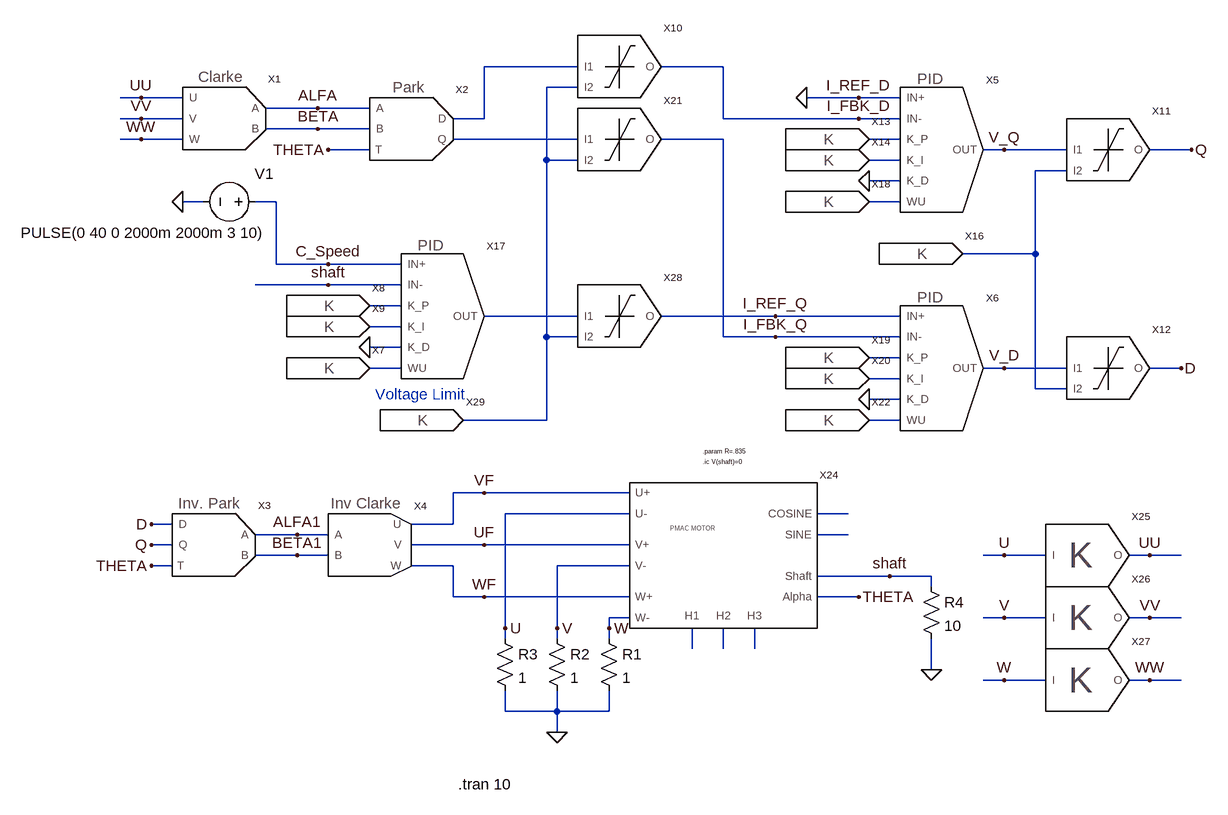
[diagram p0: schematic PMSM_Control.asc]
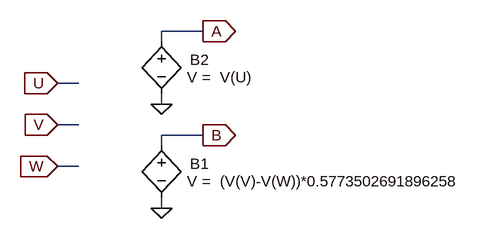
[diagram p1: sub-circuit clarke.asc]
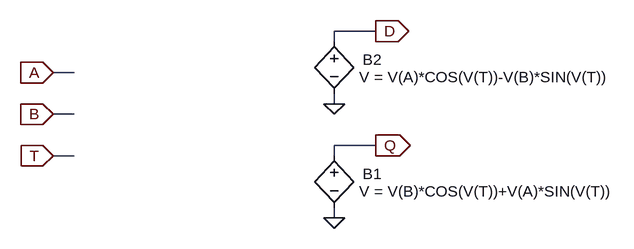
[diagram p2: sub-circuit park.asc]
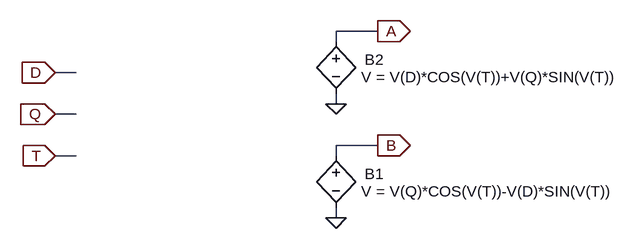
[diagram p3: sub-circuit inv_park.asc]
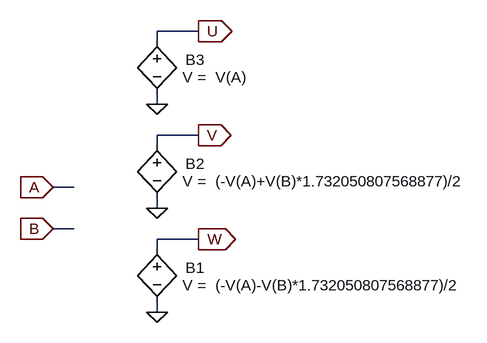
[diagram p4: sub-circuit inv_clarke.asc]
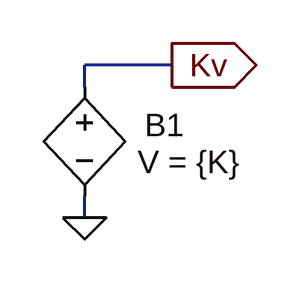
[diagram p5: sub-circuit constant_module.asc]
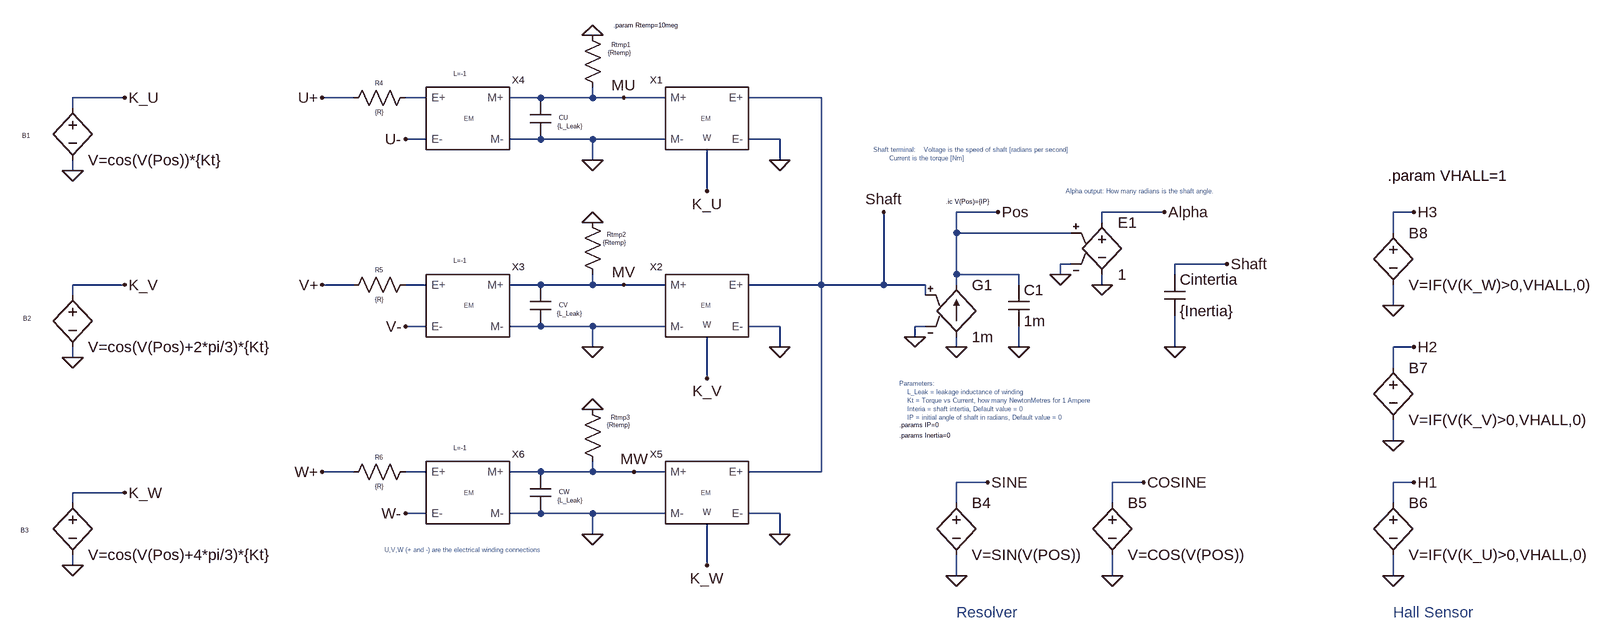
[diagram p6: sub-circuit motor_3_r_h.asc]
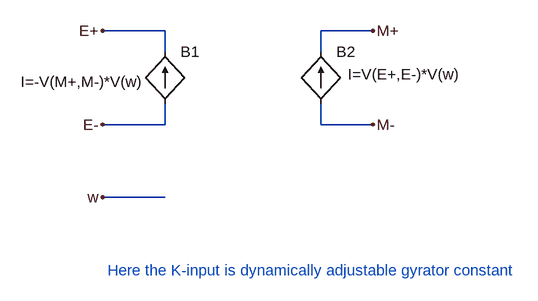
[diagram p7: sub-circuit dynamic-gyrator.asc]
PMSM_Control.asc, the LTspice schematic file:
Version 4
SHEET 1 2208 736
WIRE -528 -512 -672 -512
WIRE -304 -512 -400 -512
WIRE -528 -480 -576 -480
WIRE -1200 -464 -1232 -464
WIRE -1136 -464 -1200 -464
WIRE -96 -464 -176 -464
WIRE -32 -464 -96 -464
WIRE -928 -448 -1008 -448
WIRE -848 -448 -928 -448
WIRE -1200 -432 -1232 -432
WIRE -1136 -432 -1200 -432
WIRE -672 -432 -672 -512
WIRE -672 -432 -720 -432
WIRE -304 -432 -304 -512
WIRE -96 -432 -304 -432
WIRE -32 -432 -96 -432
WIRE -928 -416 -1008 -416
WIRE -848 -416 -928 -416
WIRE -1200 -400 -1232 -400
WIRE -1136 -400 -1200 -400
WIRE -528 -400 -720 -400
WIRE -304 -400 -400 -400
WIRE -32 -400 -80 -400
WIRE -848 -384 -912 -384
WIRE 128 -384 96 -384
WIRE 224 -384 128 -384
WIRE 416 -384 352 -384
WIRE -576 -368 -576 -480
WIRE -528 -368 -576 -368
WIRE -32 -368 -80 -368
WIRE 224 -352 176 -352
WIRE -32 -336 -80 -336
WIRE -1104 -304 -1136 -304
WIRE -992 -304 -1024 -304
WIRE -32 -304 -80 -304
WIRE 176 -224 176 -352
WIRE 176 -224 64 -224
WIRE -992 -208 -992 -304
WIRE -912 -208 -992 -208
WIRE -800 -208 -912 -208
WIRE -912 -176 -1024 -176
WIRE -800 -176 -912 -176
WIRE -800 -144 -848 -144
WIRE -528 -128 -672 -128
WIRE -224 -128 -400 -128
WIRE -32 -128 -224 -128
WIRE -800 -112 -848 -112
WIRE -576 -96 -576 -368
WIRE -528 -96 -576 -96
WIRE -304 -96 -304 -400
WIRE -224 -96 -304 -96
WIRE -32 -96 -224 -96
WIRE -800 -80 -848 -80
WIRE -32 -64 -80 -64
WIRE -800 -48 -848 -48
WIRE 128 -48 96 -48
WIRE 224 -48 128 -48
WIRE 400 -48 352 -48
WIRE -32 -32 -80 -32
WIRE 176 -16 176 -224
WIRE 224 -16 176 -16
WIRE -32 0 -80 0
WIRE -576 32 -576 -96
WIRE -576 32 -704 32
WIRE -32 32 -80 32
WIRE -672 144 -720 144
WIRE -448 144 -672 144
WIRE -448 176 -640 176
WIRE -112 176 -160 176
WIRE -1152 192 -1184 192
WIRE -720 192 -720 144
WIRE -720 192 -784 192
WIRE -960 208 -1024 208
WIRE -912 208 -960 208
WIRE -112 208 -160 208
WIRE -1152 224 -1184 224
WIRE -672 224 -784 224
WIRE -448 224 -672 224
WIRE -960 240 -1024 240
WIRE -912 240 -960 240
WIRE 128 240 96 240
WIRE 192 240 128 240
WIRE 352 240 320 240
WIRE 400 240 352 240
WIRE -1152 256 -1184 256
WIRE -720 256 -784 256
WIRE -448 256 -560 256
WIRE -48 272 -160 272
WIRE 16 272 -48 272
WIRE 16 288 16 272
WIRE -720 304 -720 256
WIRE -672 304 -720 304
WIRE -448 304 -672 304
WIRE -96 304 -160 304
WIRE -448 336 -480 336
WIRE 128 336 96 336
WIRE 192 336 128 336
WIRE 352 336 320 336
WIRE 400 336 352 336
WIRE -640 352 -640 176
WIRE -560 352 -560 256
WIRE -480 352 -480 336
WIRE -640 368 -640 352
WIRE -560 368 -560 352
WIRE -480 368 -480 352
WIRE -352 384 -352 352
WIRE -304 384 -304 352
WIRE -256 384 -256 352
WIRE 16 416 16 368
WIRE 128 432 96 432
WIRE 192 432 128 432
WIRE 352 432 320 432
WIRE 400 432 352 432
WIRE -640 480 -640 448
WIRE -560 480 -560 448
WIRE -560 480 -640 480
WIRE -480 480 -480 448
WIRE -480 480 -560 480
WIRE -560 512 -560 480
FLAG -928 -448 ALFA
FLAG -928 -416 BETA
FLAG -1184 192 D
FLAG -1184 224 Q
FLAG -912 -384 THETA
FLAG -960 208 ALFA1
FLAG -960 240 BETA1
FLAG -912 -208 C_Speed
FLAG -912 -176 shaft
FLAG -560 512 0
FLAG 16 416 0
FLAG -48 272 shaft
FLAG -1184 256 THETA
FLAG -640 352 U
FLAG -560 352 V
FLAG -480 352 W
FLAG -1136 -304 0
FLAG -176 -464 0
FLAG -96 -464 I_REF_D
FLAG -96 -432 I_FBK_D
FLAG -224 -128 I_REF_Q
FLAG -224 -96 I_FBK_Q
FLAG -96 304 THETA
FLAG 128 240 U
FLAG 128 336 V
FLAG 128 432 W
FLAG 352 240 UU
FLAG 352 336 VV
FLAG -1200 -432 VV
FLAG 352 432 WW
FLAG -1200 -400 WW
FLAG -1200 -464 UU
FLAG 416 -384 Q
FLAG 400 -48 D
FLAG -848 -80 0
FLAG -80 -336 0
FLAG -80 0 0
FLAG 128 -48 V_D
FLAG 128 -384 V_Q
FLAG -672 144 VF
FLAG -672 224 UF
FLAG -672 304 WF
SYMBOL clarke -1040 -448 R0
SYMATTR InstName X1
SYMBOL park -752 -432 R0
SYMATTR InstName X2
SYMBOL inv_park -1056 208 R0
SYMATTR InstName X3
SYMBOL inv_clarke -816 208 R0
SYMATTR InstName X4
SYMBOL constant_module -896 -160 R0
SYMATTR InstName X8
SYMATTR SpiceLine K=100
SYMBOL motor_3_R_H -320 240 R0
SYMATTR InstName X24
SYMATTR SpiceLine L_Leak=.005 R={R} Kt=.86 IP=0.06 Inertia=.0036 VHALL=5
SYMBOL res -496 352 R0
SYMATTR InstName R1
SYMATTR Value 1
SYMBOL res -576 352 R0
SYMATTR InstName R2
SYMATTR Value 1
SYMBOL res -656 352 R0
SYMATTR InstName R3
SYMATTR Value 1
SYMBOL res 0 272 R0
SYMATTR InstName R4
SYMATTR Value 10
SYMBOL constant_module -896 -128 R0
SYMATTR InstName X9
SYMATTR SpiceLine K=0
SYMBOL constant_module -128 -416 R0
SYMATTR InstName X13
SYMATTR SpiceLine K=1
SYMBOL constant_module -128 -384 R0
SYMATTR InstName X14
SYMATTR SpiceLine K=0
SYMBOL constant_module -128 -80 R0
SYMATTR InstName X19
SYMATTR SpiceLine K=1
SYMBOL constant_module -128 -48 R0
SYMATTR InstName X20
SYMATTR SpiceLine K=0
SYMBOL voltage -1008 -304 R90
WINDOW 123 0 0 Left 0
WINDOW 39 0 0 Left 0
WINDOW 0 -43 -12 VRight 2
WINDOW 3 48 -1 VRight 2
SYMATTR InstName V1
SYMATTR Value PULSE(0 40 0 2000m 2000m 3 10)
SYMBOL kmult_module 288 224 R0
SYMATTR InstName X25
SYMATTR SpiceLine K=10
SYMBOL kmult_module 288 320 R0
SYMATTR InstName X26
SYMATTR SpiceLine K=10
SYMBOL kmult_module 288 416 R0
SYMATTR InstName X27
SYMATTR SpiceLine K=10
SYMBOL limit_module 320 -400 R0
SYMATTR InstName X11
SYMBOL limit_module 320 -64 R0
SYMATTR InstName X12
SYMBOL constant_module 16 -240 R0
SYMATTR InstName X16
SYMATTR SpiceLine K=300
SYMBOL PID_WU_Diff -704 -208 R0
SYMATTR InstName X17
SYMBOL PID_WU_Diff 64 -464 R0
SYMATTR InstName X5
SYMBOL PID_WU_Diff 64 -128 R0
SYMATTR InstName X6
SYMBOL constant_module -896 -64 R0
SYMATTR InstName X7
SYMATTR SpiceLine K=20
SYMBOL constant_module -128 -320 R0
SYMATTR InstName X18
SYMATTR SpiceLine K=20
SYMBOL constant_module -128 16 R0
SYMATTR InstName X22
SYMATTR SpiceLine K=20
SYMBOL limit_module -432 -144 R0
SYMATTR InstName X28
SYMBOL constant_module -752 16 R0
SYMATTR InstName X29
SYMATTR SpiceLine k=100
SYMBOL limit_module -432 -528 R0
SYMATTR InstName X10
SYMBOL limit_module -432 -416 R0
SYMATTR InstName X21
TEXT -712 592 Left 2 !.tran 10
TEXT -336 80 Left 0 !.param R=.835
TEXT -336 96 Left 0 !.ic V(shaft)=0
TEXT -840 -8 Left 2 ;Voltage Limit

clarke.asc, the sub-circuit schematic file:
Version 4
SHEET 1 880 680
WIRE 240 0 176 0
WIRE 176 16 176 0
WIRE 48 80 16 80
WIRE 176 112 176 96
WIRE 48 144 16 144
WIRE 240 160 176 160
WIRE 176 176 176 160
WIRE 48 208 16 208
WIRE 176 272 176 256
FLAG 16 80 U
IOPIN 16 80 In
FLAG 16 144 V
IOPIN 16 144 In
FLAG 176 272 0
FLAG 240 160 B
IOPIN 240 160 Out
FLAG 16 208 W
IOPIN 16 208 In
FLAG 176 112 0
FLAG 240 0 A
IOPIN 240 0 Out
SYMBOL bv 176 160 R0
WINDOW 0 44 44 Left 0
WINDOW 3 39 71 Left 0
SYMATTR InstName B1
SYMATTR Value V =  (V(V)-V(W))*0.5773502691896258
SYMBOL bv 176 0 R0
WINDOW 0 44 44 Left 0
WINDOW 3 39 71 Left 0
SYMATTR InstName B2
SYMATTR Value V =  V(U)

park.asc, the sub-circuit schematic file:
Version 4
SHEET 1 892 680
WIRE 272 -16 208 -16
WIRE 208 0 208 -16
WIRE -192 48 -224 48
WIRE 208 96 208 80
WIRE -192 112 -224 112
WIRE 272 160 208 160
WIRE -192 176 -224 176
WIRE 208 176 208 160
WIRE 208 272 208 256
FLAG -224 48 A
IOPIN -224 48 In
FLAG -224 112 B
IOPIN -224 112 In
FLAG 208 272 0
FLAG 272 160 Q
IOPIN 272 160 Out
FLAG 208 96 0
FLAG 272 -16 D
IOPIN 272 -16 Out
FLAG -224 176 T
IOPIN -224 176 In
SYMBOL bv 208 160 R0
WINDOW 0 44 44 Left 2
WINDOW 3 39 71 Left 2
SYMATTR InstName B1
SYMATTR Value V = V(B)*COS(V(T))+V(A)*SIN(V(T))
SYMBOL bv 208 -16 R0
WINDOW 0 44 44 Left 2
WINDOW 3 39 71 Left 2
SYMATTR InstName B2
SYMATTR Value V = V(A)*COS(V(T))-V(B)*SIN(V(T))

inv_park.asc, the sub-circuit schematic file:
Version 4
SHEET 1 892 680
WIRE 272 -16 208 -16
WIRE 208 0 208 -16
WIRE -192 48 -224 48
WIRE 208 96 208 80
WIRE -192 112 -224 112
WIRE 272 160 208 160
WIRE -192 176 -224 176
WIRE 208 176 208 160
WIRE 208 272 208 256
FLAG -224 48 D
IOPIN -224 48 In
FLAG -224 112 Q
IOPIN -224 112 In
FLAG 208 272 0
FLAG 272 160 B
IOPIN 272 160 Out
FLAG 208 96 0
FLAG 272 -16 A
IOPIN 272 -16 Out
FLAG -224 176 T
IOPIN -224 176 In
SYMBOL bv 208 160 R0
WINDOW 0 44 44 Left 2
WINDOW 3 39 71 Left 2
SYMATTR InstName B1
SYMATTR Value V = V(Q)*COS(V(T))-V(D)*SIN(V(T))
SYMBOL bv 208 -16 R0
WINDOW 0 44 44 Left 2
WINDOW 3 39 71 Left 2
SYMATTR InstName B2
SYMATTR Value V = V(D)*COS(V(T))+V(Q)*SIN(V(T))

inv_clarke.asc, the sub-circuit schematic file:
Version 4
SHEET 1 880 680
WIRE 240 -160 176 -160
WIRE 176 -144 176 -160
WIRE 176 -48 176 -64
WIRE 240 0 176 0
WIRE 176 16 176 0
WIRE 48 80 16 80
WIRE 176 112 176 96
WIRE 48 144 16 144
WIRE 240 160 176 160
WIRE 176 176 176 160
WIRE 176 272 176 256
FLAG 16 80 A
IOPIN 16 80 In
FLAG 16 144 B
IOPIN 16 144 In
FLAG 176 272 0
FLAG 240 160 W
IOPIN 240 160 Out
FLAG 176 112 0
FLAG 240 0 V
IOPIN 240 0 Out
FLAG 176 -48 0
FLAG 240 -160 U
IOPIN 240 -160 Out
SYMBOL bv 176 160 R0
WINDOW 0 44 44 Left 0
WINDOW 3 39 71 Left 0
SYMATTR InstName B1
SYMATTR Value V =  (-V(A)-V(B)*1.732050807568877)/2
SYMBOL bv 176 0 R0
WINDOW 0 44 44 Left 0
WINDOW 3 39 71 Left 0
SYMATTR InstName B2
SYMATTR Value V =  (-V(A)+V(B)*1.732050807568877)/2
SYMBOL bv 176 -160 R0
WINDOW 0 44 44 Left 0
WINDOW 3 39 71 Left 0
SYMATTR InstName B3
SYMATTR Value V =  V(A)

constant_module.asc, the sub-circuit schematic file:
Version 4
SHEET 1 880 680
WIRE 240 160 176 160
WIRE 176 176 176 160
WIRE 176 272 176 256
FLAG 176 272 0
FLAG 240 160 Kv
IOPIN 240 160 Out
SYMBOL bv 176 160 R0
WINDOW 0 44 44 Left 0
WINDOW 3 39 71 Left 0
SYMATTR InstName B1
SYMATTR Value V = {K}

motor_3_r_h.asc, the sub-circuit schematic file:
Version 4
SHEET 1 1788 868
WIRE -496 -96 -576 -96
WIRE -144 -96 -192 -96
WIRE -32 -96 -64 -96
WIRE 144 -96 96 -96
WIRE 224 -96 224 -112
WIRE 224 -96 144 -96
WIRE 272 -96 224 -96
WIRE 336 -96 272 -96
WIRE 576 -96 464 -96
WIRE -576 -80 -576 -96
WIRE -32 -32 -64 -32
WIRE 144 -32 96 -32
WIRE 224 -32 144 -32
WIRE 336 -32 224 -32
WIRE 512 -32 464 -32
WIRE 224 0 224 -32
WIRE 512 0 512 -32
WIRE -576 16 -576 0
WIRE 400 48 400 -16
WIRE 848 80 784 80
WIRE 1104 80 1008 80
WIRE 1488 80 1456 80
WIRE 1008 96 1008 80
WIRE 784 112 784 80
WIRE 960 112 784 112
WIRE 1456 112 1456 80
WIRE 960 160 944 160
WIRE 1200 160 1120 160
WIRE 784 176 784 112
WIRE 880 176 784 176
WIRE 944 176 944 160
WIRE 1120 176 1120 160
WIRE -496 192 -576 192
WIRE -144 192 -192 192
WIRE -32 192 -64 192
WIRE 144 192 96 192
WIRE 224 192 224 176
WIRE 224 192 144 192
WIRE 272 192 224 192
WIRE 336 192 272 192
WIRE 576 192 576 -96
WIRE 576 192 464 192
WIRE 672 192 672 80
WIRE 672 192 576 192
WIRE 736 192 672 192
WIRE 784 192 784 176
WIRE 880 192 880 176
WIRE 1008 192 1008 176
WIRE -576 208 -576 192
WIRE 736 208 736 192
WIRE 1456 224 1456 192
WIRE -32 256 -64 256
WIRE 144 256 96 256
WIRE 224 256 144 256
WIRE 336 256 224 256
WIRE 512 256 464 256
WIRE 736 256 720 256
WIRE 720 272 720 256
WIRE 224 288 224 256
WIRE 512 288 512 256
WIRE 784 288 784 272
WIRE 880 288 880 256
WIRE 1120 288 1120 240
WIRE 1488 288 1456 288
WIRE -576 304 -576 288
WIRE 1456 320 1456 288
WIRE 400 336 400 272
WIRE 1456 432 1456 400
WIRE -144 480 -192 480
WIRE -32 480 -64 480
WIRE 144 480 96 480
WIRE 224 480 224 464
WIRE 224 480 144 480
WIRE 288 480 224 480
WIRE 336 480 288 480
WIRE 576 480 576 192
WIRE 576 480 464 480
WIRE 832 496 784 496
WIRE 1072 496 1024 496
WIRE 1488 496 1456 496
WIRE -496 512 -576 512
WIRE -576 528 -576 512
WIRE 784 528 784 496
WIRE 1024 528 1024 496
WIRE 1456 528 1456 496
WIRE -32 544 -64 544
WIRE 144 544 96 544
WIRE 224 544 144 544
WIRE 336 544 224 544
WIRE 512 544 464 544
WIRE 224 576 224 544
WIRE 512 576 512 544
WIRE -576 624 -576 608
WIRE 400 624 400 560
WIRE 784 640 784 608
WIRE 1024 640 1024 608
WIRE 1456 640 1456 608
FLAG -576 16 0
FLAG 400 336 K_V
FLAG 224 288 0
FLAG 512 288 0
FLAG 224 96 0
FLAG 880 288 0
FLAG 784 288 0
FLAG 720 272 0
FLAG 848 80 Pos
FLAG -192 192 V+
FLAG -64 256 V-
FLAG 672 80 Shaft
FLAG -576 624 0
FLAG -576 304 0
FLAG -496 -96 K_U
FLAG -496 192 K_V
FLAG -496 512 K_W
FLAG 400 48 K_U
FLAG 224 0 0
FLAG 512 0 0
FLAG 224 -192 0
FLAG -192 -96 U+
FLAG -64 -32 U-
FLAG 400 624 K_W
FLAG 224 576 0
FLAG 512 576 0
FLAG 224 384 0
FLAG -192 480 W+
FLAG -64 544 W-
FLAG 272 -96 MU
FLAG 272 192 MV
FLAG 288 480 MW
FLAG 944 176 0
FLAG 1008 192 0
FLAG 1104 80 Alpha
FLAG 1200 160 Shaft
FLAG 1120 288 0
FLAG 784 640 0
FLAG 1024 640 0
FLAG 832 496 SINE
FLAG 1072 496 COSINE
FLAG 1456 640 0
FLAG 1488 496 H1
FLAG 1456 432 0
FLAG 1488 288 H2
FLAG 1456 224 0
FLAG 1488 80 H3
SYMBOL dynamic-gyrator 400 224 M0
SYMATTR InstName X2
SYMBOL gyrator 32 224 R0
WINDOW 39 -22 -69 Left 0
SYMATTR SpiceLine L=-1
SYMATTR InstName X3
SYMBOL bv -576 -96 R0
WINDOW 0 -78 58 Left 0
SYMATTR InstName B1
SYMATTR Value V=cos(V(Pos))*{Kt}
SYMBOL g 784 176 R0
SYMATTR InstName G1
SYMATTR Value 1m
SYMBOL cap 864 192 R0
SYMATTR InstName C1
SYMATTR Value 1m
SYMBOL cap 128 192 R0
WINDOW 0 44 31 Left 0
WINDOW 3 41 44 Left 0
SYMATTR InstName CV
SYMATTR Value {L_Leak}
SYMBOL bv -576 192 R0
WINDOW 0 -76 52 Left 0
SYMATTR InstName B2
SYMATTR Value V=cos(V(Pos)+2*pi/3)*{Kt}
SYMBOL bv -576 512 R0
WINDOW 0 -80 58 Left 0
SYMATTR InstName B3
SYMATTR Value V=cos(V(Pos)+4*pi/3)*{Kt}
SYMBOL dynamic-gyrator 400 -64 M0
SYMATTR InstName X1
SYMBOL gyrator 32 -64 R0
WINDOW 39 -22 -69 Left 0
SYMATTR SpiceLine L=-1
SYMATTR InstName X4
SYMBOL cap 128 -96 R0
WINDOW 0 44 31 Left 0
WINDOW 3 42 44 Left 0
SYMATTR InstName CU
SYMATTR Value {L_Leak}
SYMBOL dynamic-gyrator 400 512 M0
SYMATTR InstName X5
SYMBOL gyrator 32 512 R0
WINDOW 39 -22 -69 Left 0
SYMATTR SpiceLine L=-1
SYMATTR InstName X6
SYMBOL cap 128 480 R0
WINDOW 0 44 31 Left 0
WINDOW 3 42 44 Left 0
SYMATTR InstName CW
SYMATTR Value {L_Leak}
SYMBOL res 208 -208 R0
WINDOW 0 45 30 Left 0
WINDOW 3 40 43 Left 0
SYMATTR InstName Rtmp1
SYMATTR Value {Rtemp}
SYMBOL res 208 80 R0
WINDOW 0 38 35 Left 0
WINDOW 3 32 47 Left 0
SYMATTR InstName Rtmp2
SYMATTR Value {Rtemp}
SYMBOL res 208 368 R0
WINDOW 0 44 28 Left 0
WINDOW 3 38 40 Left 0
SYMATTR InstName Rtmp3
SYMATTR Value {Rtemp}
SYMBOL res -48 -112 R90
WINDOW 0 0 56 VBottom 0
WINDOW 3 32 56 VTop 0
SYMATTR InstName R4
SYMATTR Value {R}
SYMBOL res -48 176 R90
WINDOW 0 0 56 VBottom 0
WINDOW 3 32 56 VTop 0
SYMATTR InstName R5
SYMATTR Value {R}
SYMBOL res -48 464 R90
WINDOW 0 0 56 VBottom 0
WINDOW 3 32 56 VTop 0
SYMATTR InstName R6
SYMATTR Value {R}
SYMBOL e 1008 80 R0
SYMATTR InstName E1
SYMATTR Value 1
SYMBOL cap 1104 176 R0
SYMATTR InstName Cintertia
SYMATTR Value {Inertia}
SYMBOL bv 784 512 R0
SYMATTR InstName B4
SYMATTR Value V=SIN(V(POS))
SYMBOL bv 1024 512 R0
SYMATTR InstName B5
SYMATTR Value V=COS(V(POS))
SYMBOL bv 1456 512 R0
SYMATTR InstName B6
SYMATTR Value V=IF(V(K_U)>0,VHALL,0)
SYMBOL bv 1456 304 R0
SYMATTR InstName B7
SYMATTR Value V=IF(V(K_V)>0,VHALL,0)
SYMBOL bv 1456 96 R0
SYMATTR InstName B8
SYMATTR Value V=IF(V(K_W)>0,VHALL,0)
TEXT 768 64 Left 0 !.ic V(Pos)={IP}
TEXT 256 -208 Left 0 !.param Rtemp=10meg
TEXT 656 -16 Left 0 ;Shaft terminal:	Voltage is the speed of shaft [radians per second]\n		Current is the torque [Nm]
TEXT -96 600 Left 0 ;U,V,W (+ and -) are the electrical winding connections
TEXT 696 344 Left 0 ;Parameters:\n	L_Leak = leakage inductance of winding\n	Kt = Torque vs Current, how many NewtonMetres for 1 Ampere\n	Interia = shaft intertia, Default value = 0\n	IP = initial angle of shaft in radians, Default value = 0
TEXT 952 48 Left 0 ;Alpha output: How many radians is the shaft angle.
TEXT 696 424 Left 0 !.params Inertia=0
TEXT 696 408 Left 0 !.params IP=0
TEXT 1448 24 Left 2 !.param VHALL=1
TEXT 784 696 Left 2 ;Resolver
TEXT 1456 696 Left 2 ;Hall Sensor

dynamic-gyrator.asc, the sub-circuit schematic file:
Version 4
SHEET 1 1268 680
WIRE -176 48 -272 48
WIRE 144 48 64 48
WIRE -176 80 -176 48
WIRE 64 80 64 48
WIRE -176 192 -176 160
WIRE -176 192 -272 192
WIRE 64 192 64 160
WIRE 144 192 64 192
WIRE -176 304 -272 304
FLAG -272 48 E+
FLAG -272 192 E-
FLAG 144 48 M+
FLAG 144 192 M-
FLAG -272 304 w
SYMBOL bi2 -176 80 R0
WINDOW 3 -222 46 Left 0
SYMATTR Value I=-V(M+,M-)*V(w)
SYMATTR InstName B1
SYMBOL bi2 64 80 R0
WINDOW 3 42 35 Left 0
SYMATTR Value I=V(E+,E-)*V(w)
SYMATTR InstName B2
TEXT -264 416 Left 0 ;Here the K-input is dynamically adjustable gyrator constant

gyrator.asc, the sub-circuit schematic file:
Version 4
SHEET 1 1268 680
WIRE -176 48 -272 48
WIRE -176 80 -176 48
WIRE -176 192 -272 192
WIRE -176 192 -176 160
WIRE -80 48 -176 48
WIRE -80 96 -128 96
WIRE -80 144 -128 144
WIRE -80 192 -176 192
WIRE -32 48 -80 96
WIRE -32 96 -80 48
WIRE -32 144 -80 192
WIRE -32 192 -80 144
WIRE 16 96 -32 96
WIRE 16 144 -32 144
WIRE 64 48 -32 48
WIRE 64 80 64 48
WIRE 64 192 -32 192
WIRE 64 192 64 160
WIRE 144 48 64 48
WIRE 144 192 64 192
FLAG -272 48 E+
FLAG -272 192 E-
FLAG 144 48 M+
FLAG 144 192 M-
SYMBOL g 64 64 R0
SYMATTR InstName G1
SYMATTR Value {1/L}
SYMBOL g -176 64 M0
SYMATTR InstName G2
SYMATTR Value {-1/L}
TEXT -56 232 Center 0 ;Model of gyrator for \nmodeling electrical winding.

kmult_module.asc, the sub-circuit schematic file:
Version 4
SHEET 1 880 680
WIRE 240 160 176 160
WIRE 176 176 176 160
WIRE 64 192 32 192
WIRE 176 272 176 256
FLAG 32 192 I
IOPIN 32 192 In
FLAG 176 272 0
FLAG 240 160 O
IOPIN 240 160 Out
SYMBOL bv 176 160 R0
WINDOW 0 44 44 Left 0
WINDOW 3 39 71 Left 0
SYMATTR InstName B1
SYMATTR Value V = V(I)*{k}

limit_module.asc, the sub-circuit schematic file:
Version 4
SHEET 1 880 680
WIRE 240 160 176 160
WIRE 176 176 176 160
WIRE 64 192 32 192
WIRE 64 256 32 256
WIRE 176 272 176 256
FLAG 32 192 I1
IOPIN 32 192 In
FLAG 32 256 I2
IOPIN 32 256 In
FLAG 176 272 0
FLAG 240 160 O
IOPIN 240 160 Out
SYMBOL bv 176 160 R0
WINDOW 0 44 44 Left 0
WINDOW 3 39 71 Left 0
SYMATTR InstName B1
SYMATTR Value V =  limit(V(I1),-abs(V(I2)),abs(V(I2)))

pid_wu_diff.asc, the sub-circuit schematic file:
Version 4
SHEET 1 2148 680
WIRE 1312 112 992 112
WIRE 1520 144 1440 144
WIRE 1072 176 1040 176
WIRE 1312 176 1280 176
WIRE 1712 176 1632 176
WIRE 768 192 560 192
WIRE 1072 208 1024 208
WIRE 1520 208 1472 208
WIRE 1872 208 1824 208
WIRE 992 224 992 112
WIRE 992 224 880 224
WIRE 1024 224 1024 208
WIRE 1024 224 992 224
WIRE 1312 224 1200 224
WIRE 1040 240 1040 176
WIRE 1072 240 1040 240
WIRE 1712 240 1664 240
WIRE 608 256 560 256
WIRE 768 256 736 256
WIRE 1472 256 1472 208
WIRE 1472 256 1440 256
WIRE 1072 272 944 272
WIRE 1040 288 1040 240
WIRE 1312 288 1280 288
WIRE 992 336 992 224
WIRE 1072 336 992 336
WIRE 1312 336 1200 336
WIRE 1664 368 1664 240
WIRE 1664 368 1440 368
WIRE 1312 400 1280 400
FLAG 1872 208 OUT
IOPIN 1872 208 Out
FLAG 1280 176 K_P
IOPIN 1280 176 In
FLAG 1280 288 K_I
IOPIN 1280 288 In
FLAG 1280 400 K_D
IOPIN 1280 400 In
FLAG 1040 288 0
FLAG 560 192 IN+
IOPIN 560 192 In
FLAG 560 256 IN-
IOPIN 560 256 In
FLAG 944 272 WU
IOPIN 944 272 In
SYMBOL derivator_module 1168 320 R0
SYMATTR InstName X2
SYMATTR SpiceLine k=0
SYMBOL multiplier_module 1408 128 R0
SYMATTR InstName X3
SYMBOL multiplier_module 1408 240 R0
SYMATTR InstName X4
SYMBOL multiplier_module 1408 352 R0
SYMATTR InstName X5
SYMBOL sum_module 1600 160 R0
SYMATTR InstName X6
SYMBOL sum_module 1792 192 R0
SYMATTR InstName X7
SYMBOL sum_module 848 208 R0
SYMATTR InstName X8
SYMBOL neg_module 704 240 R0
SYMATTR InstName X9
SYMBOL integrator_WU_module 1216 192 R0
SYMATTR InstName X1

derivator_module.asc, the sub-circuit schematic file:
Version 4
SHEET 1 880 680
WIRE 240 160 176 160
WIRE 176 176 176 160
WIRE 64 192 32 192
WIRE 176 272 176 256
FLAG 32 192 I
IOPIN 32 192 In
FLAG 176 272 0
FLAG 240 160 O
IOPIN 240 160 Out
SYMBOL bv 176 160 R0
WINDOW 0 44 44 Left 0
WINDOW 3 39 71 Left 0
SYMATTR InstName B1
SYMATTR Value V = ddt(V(I))

multiplier_module.asc, the sub-circuit schematic file:
Version 4
SHEET 1 880 680
WIRE 240 160 176 160
WIRE 176 176 176 160
WIRE 64 192 32 192
WIRE 64 256 32 256
WIRE 176 272 176 256
FLAG 32 192 I1
IOPIN 32 192 In
FLAG 32 256 I2
IOPIN 32 256 In
FLAG 176 272 0
FLAG 240 160 O
IOPIN 240 160 Out
SYMBOL bv 176 160 R0
WINDOW 0 44 44 Left 0
WINDOW 3 39 71 Left 0
SYMATTR InstName B1
SYMATTR Value V =  V(I1) * V(I2)

sum_module.asc, the sub-circuit schematic file:
Version 4
SHEET 1 880 680
WIRE 240 160 176 160
WIRE 176 176 176 160
WIRE 64 192 32 192
WIRE 64 256 32 256
WIRE 176 272 176 256
FLAG 32 192 I1
IOPIN 32 192 In
FLAG 32 256 I2
IOPIN 32 256 In
FLAG 176 272 0
FLAG 240 160 O
IOPIN 240 160 Out
SYMBOL bv 176 160 R0
WINDOW 0 44 44 Left 0
WINDOW 3 39 71 Left 0
SYMATTR InstName B1
SYMATTR Value V =  V(I1)  + V(I2)

neg_module.asc, the sub-circuit schematic file:
Version 4
SHEET 1 880 680
WIRE 240 160 176 160
WIRE 176 176 176 160
WIRE 64 192 32 192
WIRE 176 272 176 256
FLAG 32 192 I
IOPIN 32 192 In
FLAG 176 272 0
FLAG 240 160 O
IOPIN 240 160 Out
SYMBOL bv 176 160 R0
WINDOW 0 44 44 Left 0
WINDOW 3 39 71 Left 0
SYMATTR InstName B1
SYMATTR Value V =  - V(I)

integrator_wu_module.asc, the sub-circuit schematic file:
Version 4
SHEET 1 880 680
WIRE 128 160 112 160
WIRE 320 160 256 160
WIRE 256 176 256 160
WIRE 128 208 96 208
WIRE 128 272 112 272
WIRE 256 272 256 256
WIRE 128 336 112 336
WIRE 288 336 256 336
FLAG 96 208 I
IOPIN 96 208 In
FLAG 256 272 0
FLAG 320 160 O
IOPIN 320 160 Out
FLAG 112 272 IC
IOPIN 112 272 In
FLAG 112 160 Res
IOPIN 112 160 In
FLAG 112 336 WU
IOPIN 112 336 In
FLAG 288 336 W
SYMBOL bv 256 160 R0
WINDOW 0 44 44 Left 0
WINDOW 3 39 71 Left 0
SYMATTR InstName B1
SYMATTR Value V = idt (V(I) * ((V(I) > 0 & V(O) < V(WU)) | ((V(I) < 0) & V(O) > -v(WU))))
SYMBOL abs_module 224 320 R0
SYMATTR InstName X1

abs_module.asc, the sub-circuit schematic file:
Version 4
SHEET 1 880 680
WIRE 240 160 176 160
WIRE 176 176 176 160
WIRE 64 192 32 192
WIRE 176 272 176 256
FLAG 32 192 I
IOPIN 32 192 In
FLAG 176 272 0
FLAG 240 160 O
IOPIN 240 160 Out
SYMBOL bv 176 160 R0
WINDOW 0 44 44 Left 0
WINDOW 3 39 71 Left 0
SYMATTR InstName B1
SYMATTR Value V =  abs(V(I))

The netlist it stands for:
* PMSM_Control.asc
XX1 BETA UU WW VV ALFA clarke
XX2 N001 N003 ALFA BETA THETA park
XX3 ALFA1 BETA1 D Q THETA inv_park
XX4 BETA1 VF WF UF ALFA1 inv_clarke
XX8 N008 constant_module params: K=100
XX24 VF U UF V WF W shaft THETA N016 N015 N017 N018 N019 motor_3_r_h params: L_Leak=.005 R={R} Kt=.86 IP=0.06 Inertia=.0036 VHALL=5
R1 W 0 1
R2 V 0 1
R3 U 0 1
R4 shaft 0 10
XX9 N010 constant_module params: K=0
XX13 N004 constant_module params: K=1
XX14 N005 constant_module params: K=0
XX19 N011 constant_module params: K=1
XX20 N013 constant_module params: K=0
V1 C_Speed 0 PULSE(0 40 0 2000m 2000m 3 10)
XX25 UU U kmult_module params: K=10
XX26 VV V kmult_module params: K=10
XX27 WW W kmult_module params: K=10
XX11 Q V_Q N006 limit_module
XX12 D V_D N006 limit_module
XX16 N006 constant_module params: K=300
XX17 N009 N008 0 N010 C_Speed shaft N012 pid_wu_diff
XX5 V_Q N004 0 N005 0 I_FBK_D N007 pid_wu_diff
XX6 V_D N011 0 N013 I_REF_Q I_FBK_Q N014 pid_wu_diff
XX7 N012 constant_module params: K=20
XX18 N007 constant_module params: K=20
XX22 N014 constant_module params: K=20
XX28 I_REF_Q N009 N002 limit_module
XX29 N002 constant_module params: k=100
XX10 I_FBK_D N001 N002 limit_module
XX21 I_FBK_Q N003 N002 limit_module

* block symbol definitions
.subckt clarke B U W V A
B1 B 0 V =  (V(V)-V(W))*0.5773502691896258
B2 A 0 V =  V(U)
.ends clarke

.subckt park D Q A B T
B1 Q 0 V = V(B)*COS(V(T))+V(A)*SIN(V(T))
B2 D 0 V = V(A)*COS(V(T))-V(B)*SIN(V(T))
.ends park

.subckt inv_park A B D Q T
B1 B 0 V = V(Q)*COS(V(T))-V(D)*SIN(V(T))
B2 A 0 V = V(D)*COS(V(T))+V(Q)*SIN(V(T))
.ends inv_park

.subckt inv_clarke B U W V A
B1 W 0 V =  (-V(A)-V(B)*1.732050807568877)/2
B2 V 0 V =  (-V(A)+V(B)*1.732050807568877)/2
B3 U 0 V =  V(A)
.ends inv_clarke

.subckt constant_module Kv
B1 Kv 0 V = {K}
.ends constant_module

.subckt motor_3_r_h U+ U- V+ V- W+ W- Shaft Alpha SINE COSINE H1 H2 H3
XX2 Shaft 0 MV 0 K_V dynamic-gyrator
XX3 N002 V- MV 0 gyrator params: L=-1
B1 K_U 0 V=cos(V(Pos))*{Kt}
G1 0 Pos Shaft 0 1m
C1 Pos 0 1m
CV MV 0 {L_Leak}
B2 K_V 0 V=cos(V(Pos)+2*pi/3)*{Kt}
B3 K_W 0 V=cos(V(Pos)+4*pi/3)*{Kt}
XX1 Shaft 0 MU 0 K_U dynamic-gyrator
XX4 N001 U- MU 0 gyrator params: L=-1
CU MU 0 {L_Leak}
XX5 Shaft 0 MW 0 K_W dynamic-gyrator
XX6 N003 W- MW 0 gyrator params: L=-1
CW MW 0 {L_Leak}
Rtmp1 0 MU {Rtemp}
Rtmp2 0 MV {Rtemp}
Rtmp3 0 MW {Rtemp}
R4 N001 U+ {R}
R5 N002 V+ {R}
R6 N003 W+ {R}
E1 Alpha 0 Pos 0 1
Cintertia Shaft 0 {Inertia}
B4 SINE 0 V=SIN(V(POS))
B5 COSINE 0 V=COS(V(POS))
B6 H1 0 V=IF(V(K_U)>0,VHALL,0)
B7 H2 0 V=IF(V(K_V)>0,VHALL,0)
B8 H3 0 V=IF(V(K_W)>0,VHALL,0)
.ic V(Pos)={IP}
.param Rtemp=10meg
* Shaft terminal:	Voltage is the speed of shaft [radians per second]
* 		Current is the torque [Nm]
* U,V,W (+ and -) are the electrical winding connections
* Parameters:
* 	L_Leak = leakage inductance of winding
* 	Kt = Torque vs Current, how many NewtonMetres for 1 Ampere
* 	Interia = shaft intertia, Default value = 0
* 	IP = initial angle of shaft in radians, Default value = 0
* Alpha output: How many radians is the shaft angle.
.params Inertia=0
.params IP=0
.param VHALL=1
* Resolver
* Hall Sensor
.ends motor_3_r_h

.subckt dynamic-gyrator E+ E- M+ M- w
B1 E- E+ I=-V(M+,M-)*V(w)
B2 M- M+ I=V(E+,E-)*V(w)
* Here the K-input is dynamically adjustable gyrator constant
.ends dynamic-gyrator

.subckt gyrator E+ E- M+ M-
G1 M- M+ E+ E- {1/L}
G2 E- E+ M+ M- {-1/L}
* Model of gyrator for
* modeling electrical winding.
.ends gyrator

.subckt kmult_module O I
B1 O 0 V = V(I)*{k}
.ends kmult_module

.subckt limit_module O I1 I2
B1 O 0 V =  limit(V(I1),-abs(V(I2)),abs(V(I2)))
.ends limit_module

.subckt pid_wu_diff OUT K_P K_D K_I IN+ IN- WU
XX2 N008 N001 derivator_module params: k=0
XX3 N002 N001 K_P multiplier_module
XX4 N004 N005 K_I multiplier_module
XX5 N006 N008 K_D multiplier_module
XX6 N003 N002 N004 sum_module
XX7 OUT N003 N006 sum_module
XX8 N001 IN+ N007 sum_module
XX9 N007 IN- neg_module
XX1 N005 N001 0 0 WU integrator_wu_module
.ends pid_wu_diff

.subckt derivator_module O I
B1 O 0 V = ddt(V(I))
.ends derivator_module

.subckt multiplier_module O I1 I2
B1 O 0 V =  V(I1) * V(I2)
.ends multiplier_module

.subckt sum_module O I1 I2
B1 O 0 V =  V(I1)  + V(I2)
.ends sum_module

.subckt neg_module O I
B1 O 0 V =  - V(I)
.ends neg_module

.subckt integrator_wu_module O I IC RES WU
B1 O 0 V = idt (V(I) * ((V(I) > 0 & V(O) < V(WU)) | ((V(I) < 0) & V(O) > -v(WU))))
XX1 W WU abs_module
.ends integrator_wu_module

.subckt abs_module O I
B1 O 0 V =  abs(V(I))
.ends abs_module

.tran 10
.param R=.835
.ic V(shaft)=0
* Voltage Limit
.backanno
.end